# Altium schematic sheet Omega Schematic.SchDoc
size A4
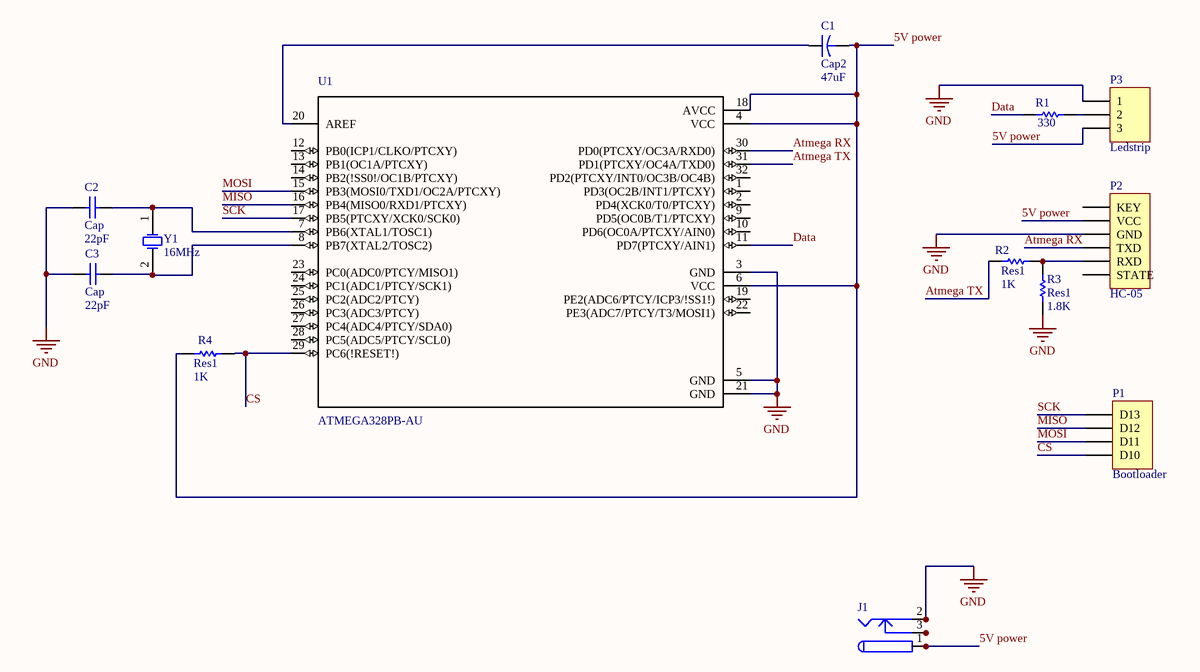
[diagram p0: Omega Schematic.SchDoc]

## Parts
C1  Cap2  value 47uF  [CAPR5-4X5]
C2  Cap  value 22pF  [6-0805_N]
C3  Cap  value 22pF  [6-0805_N]
J1  PWR2.5  [KLD-0202]  (value not drawn)
P1  Bootloader  [HDR1X4H]
P2  HC-05  [HDR1X6]
P3  Ledstrip  [HDR1X3H]
R1  value 330  [6-0805_N]  (hidden comment: Res1)
R2  Res1  value 1K  [6-0805_N]
R3  Res1  value 1.8K  [6-0805_N]
R4  Res1  value 1K  [6-0805_N]
U1  ATMEGA328PB-AU  [*QFP80P900X900X120-32N]
Y1  16MHz  [R38]

## Nets
GND: C2.1 C3.1 J1.2 J1.2A J1.2B P2.3(GND) P3.1 R3.1 U1.3(GND) U1.5(GND) U1.21(GND)
5V power: C1.2 J1.1 J1.1A J1.1B P2.2(VCC) P3.3 R4.1 U1.4(VCC) U1.6(VCC) U1.18(AVCC)
Atmega RX: P2.4(TXD) U1.30(PD0(PTCXY/OC3A/RXD0))
Atmega TX: R2.2 U1.31(PD1(PTCXY/OC4A/TXD0))
CS: P1.4(D10) R4.2 U1.29(PC6(!RESET!))
Data: R1.1 U1.11(PD7(PTCXY/AIN1))
MISO: P1.2(D12) U1.16(PB4(MISO0/RXD1/PTCXY))
MOSI: P1.3(D11) U1.15(PB3(MOSI0/TXD1/OC2A/PTCXY))
SCK: P1.1(D13) U1.17(PB5(PTCXY/XCK0/SCK0))
NetC1_1: C1.1 U1.20(AREF)
NetC2_2: C2.2 U1.7(PB6(XTAL1/TOSC1)) Y1.1(OSC1)
NetC3_2: C3.2 U1.8(PB7(XTAL2/TOSC2)) Y1.2(OSC2)
NetJ1_3: J1.3 J1.3A J1.3B
NetP2_5: P2.5(RXD) R2.1 R3.2
NetP3_2: P3.2 R1.2

Not connected (* = marked no-connect by the designer): P2 1(KEY) 6(STATE); U1 1(PD3(OC2B/INT1/PTCXY)) 2(PD4(XCK0/T0/PTCXY)) 9(PD5(OC0B/T1/PTCXY)) 10(PD6(OC0A/PTCXY/AIN0)) 12(PB0(ICP1/CLKO/PTCXY)) 13(PB1(OC1A/PTCXY)) 14(PB2(!SS0!/OC1B/PTCXY)) 19(PE2(ADC6/PTCY/ICP3/!SS1!)) 22(PE3(ADC7/PTCY/T3/MOSI1)) 23(PC0(ADC0/PTCY/MISO1)) 24(PC1(ADC1/PTCY/SCK1)) 25(PC2(ADC2/PTCY)) 26(PC3(ADC3/PTCY)) 27(PC4(ADC4/PTCY/SDA0)) 28(PC5(ADC5/PTCY/SCL0)) 32(PD2(PTCXY/INT0/OC3B/OC4B))

## Library data of the parts
C1 = Cap2: Capacitor; Published: 23-Sep-2002; PackageReference: CAPR5-4X5; Publisher: Altium Limited; PackageDescription: Capacitor; 2 Leads
C2 C3 = Cap: Capacitor; Published: 8-Jun-2000; LatestRevisionDate: 17-Jul-2002; LatestRevisionNote: Re-released for DXP Platform.; PackageReference: RAD-0.3; Publisher: Altium Limited; PackageDescription: Radial Cap, Thru-Hole; 2 Leads; 0.3 in Pin Spacing
J1 = PWR2.5: Low Voltage Power Supply Connector; Published: 17-Dec-2003; DatasheetDocument: 09-May-2002; Publisher: Altium Limited; ComponentLink1Description: Manufacturer Link; ComponentLink1URL: http://domino.kycon.com/internet/Products.html
P1 = Header 4H: Header, 4-Pin, Right Angle; LatestRevisionDate: 17-Jul-2002; LatestRevisionNote: Re-released for DXP Platform.; Publisher: Altium Limited
P2 = Header 6: Header, 6-Pin; LatestRevisionDate: 17-Jul-2002; LatestRevisionNote: Re-released for DXP Platform.; Publisher: Altium Limited
P3 = Header 3: Header, 3-Pin; LatestRevisionDate: 17-Jul-2002; LatestRevisionNote: Re-released for DXP Platform.; Publisher: Altium Limited
R1-R4 = Res1: Resistor; Published: 8-Jun-2000; LatestRevisionDate: 17-Jul-2002; LatestRevisionNote: Re-released for DXP Platform.; PackageReference: AXIAL-0.3; Publisher: Altium Limited; PackageDescription: Axial Device, Thru-Hole; 2 Leads; 0.3 in Pin Spacing
U1 = ATMEGA328PB-AU: / AVR AVRÂ® ATmega Microcontroller IC 8-Bit 20MHz 32KB _16K x 16_ FLASH 32-TQFP _7x7_ /; MF: Microchip Technology; Package: TQFP-32 Microchip Technology; MP: ATMEGA328PB-AU; Digi-Key_Purchase_URL: https://www.digikey.com/product-detail/en/microchip-technology/ATMEGA328PB-AU/ATMEGA328PB-AU-ND/5638812?utm_source=snapeda&utm_medium=aggregator&utm_campaign=symbol; Digi-Key_Part_Number: ATMEGA328PB-AU-ND; SnapEDA_Link: https://www.snapeda.com/parts/ATMEGA328PB-AU/Microchip/view-part/4478285/?ref=snap; Value: *
Y1 = XTAL: Crystal Oscillator; Published: 8-Jun-2000; LatestRevisionDate: 17-Jul-2002; LatestRevisionNote: Re-released for DXP Platform.; PackageReference: R38; Publisher: Altium Limited; PackageDescription: Crystal, Thru-Hole; 2 Leads; Body 3.1 x 8.2 mm (Dia.xH)